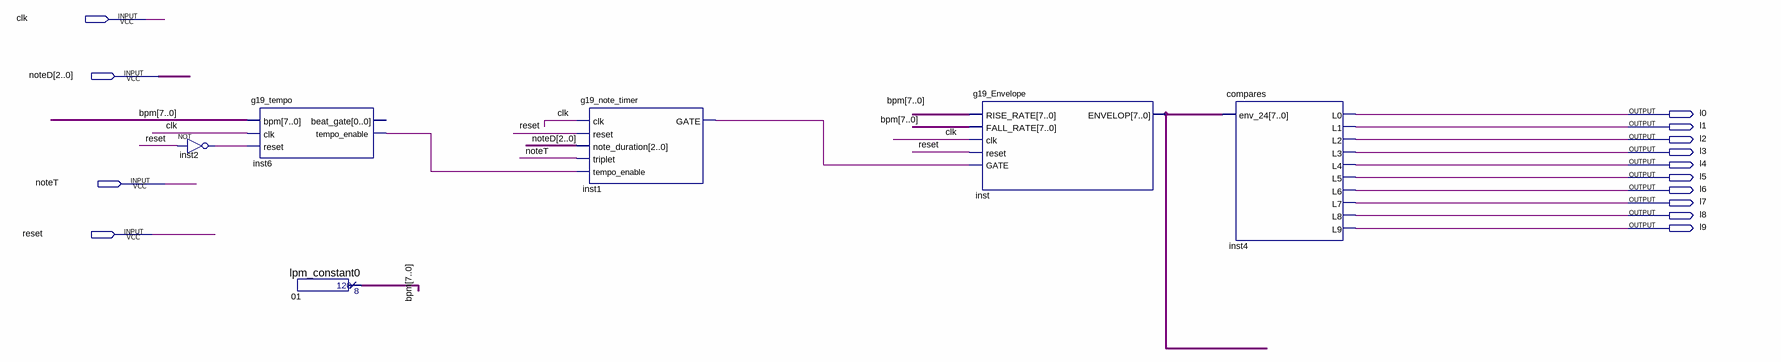
[diagram p0: schematic sheet]
// Quartus schematic timmer.bdf as structural Verilog: 6 symbols, 14 pins
module timmer (
  input  clk,
  input  [2:0] noteD,
  input  noteT,
  input  reset,
  output l0,
  output l1,
  output l2,
  output l3,
  output l4,
  output l5,
  output l6,
  output l7,
  output l8,
  output l9
);

  wire inst1_gate, inst2_out, inst6_tempo_enable;
  wire [7:0] bpm, inst_envelop;

  not inst2 (inst2_out, reset);
  g19_tempo inst6 (.bpm(bpm), .clk(clk), .reset(inst2_out), .tempo_enable(inst6_tempo_enable));  // open: beat_gate
  lpm_constant0 u_01 (.result(bpm));
  g19_note_timer inst1 (
    .clk(clk), .reset(reset), .note_duration(noteD), .triplet(noteT), .tempo_enable(inst6_tempo_enable),
    .GATE(inst1_gate));
  g19_Envelope inst (
    .RISE_RATE(bpm), .FALL_RATE(bpm), .clk(clk), .reset(reset), .GATE(inst1_gate), .ENVELOP(inst_envelop));
  compares inst4 (
    .env_24(inst_envelop), .L0(l0), .L1(l1), .L2(l2), .L3(l3), .L4(l4), .L5(l5), .L6(l6), .L7(l7), .L8(l8),
    .L9(l9));
endmodule
